# Altium schematic sheet P_PCIE_ETH.SchDoc
size 420 x 297 mm; Author: ALTIUM GOSTBOM2.0 KEV; SheetNumber: 25; SheetTotal: 48
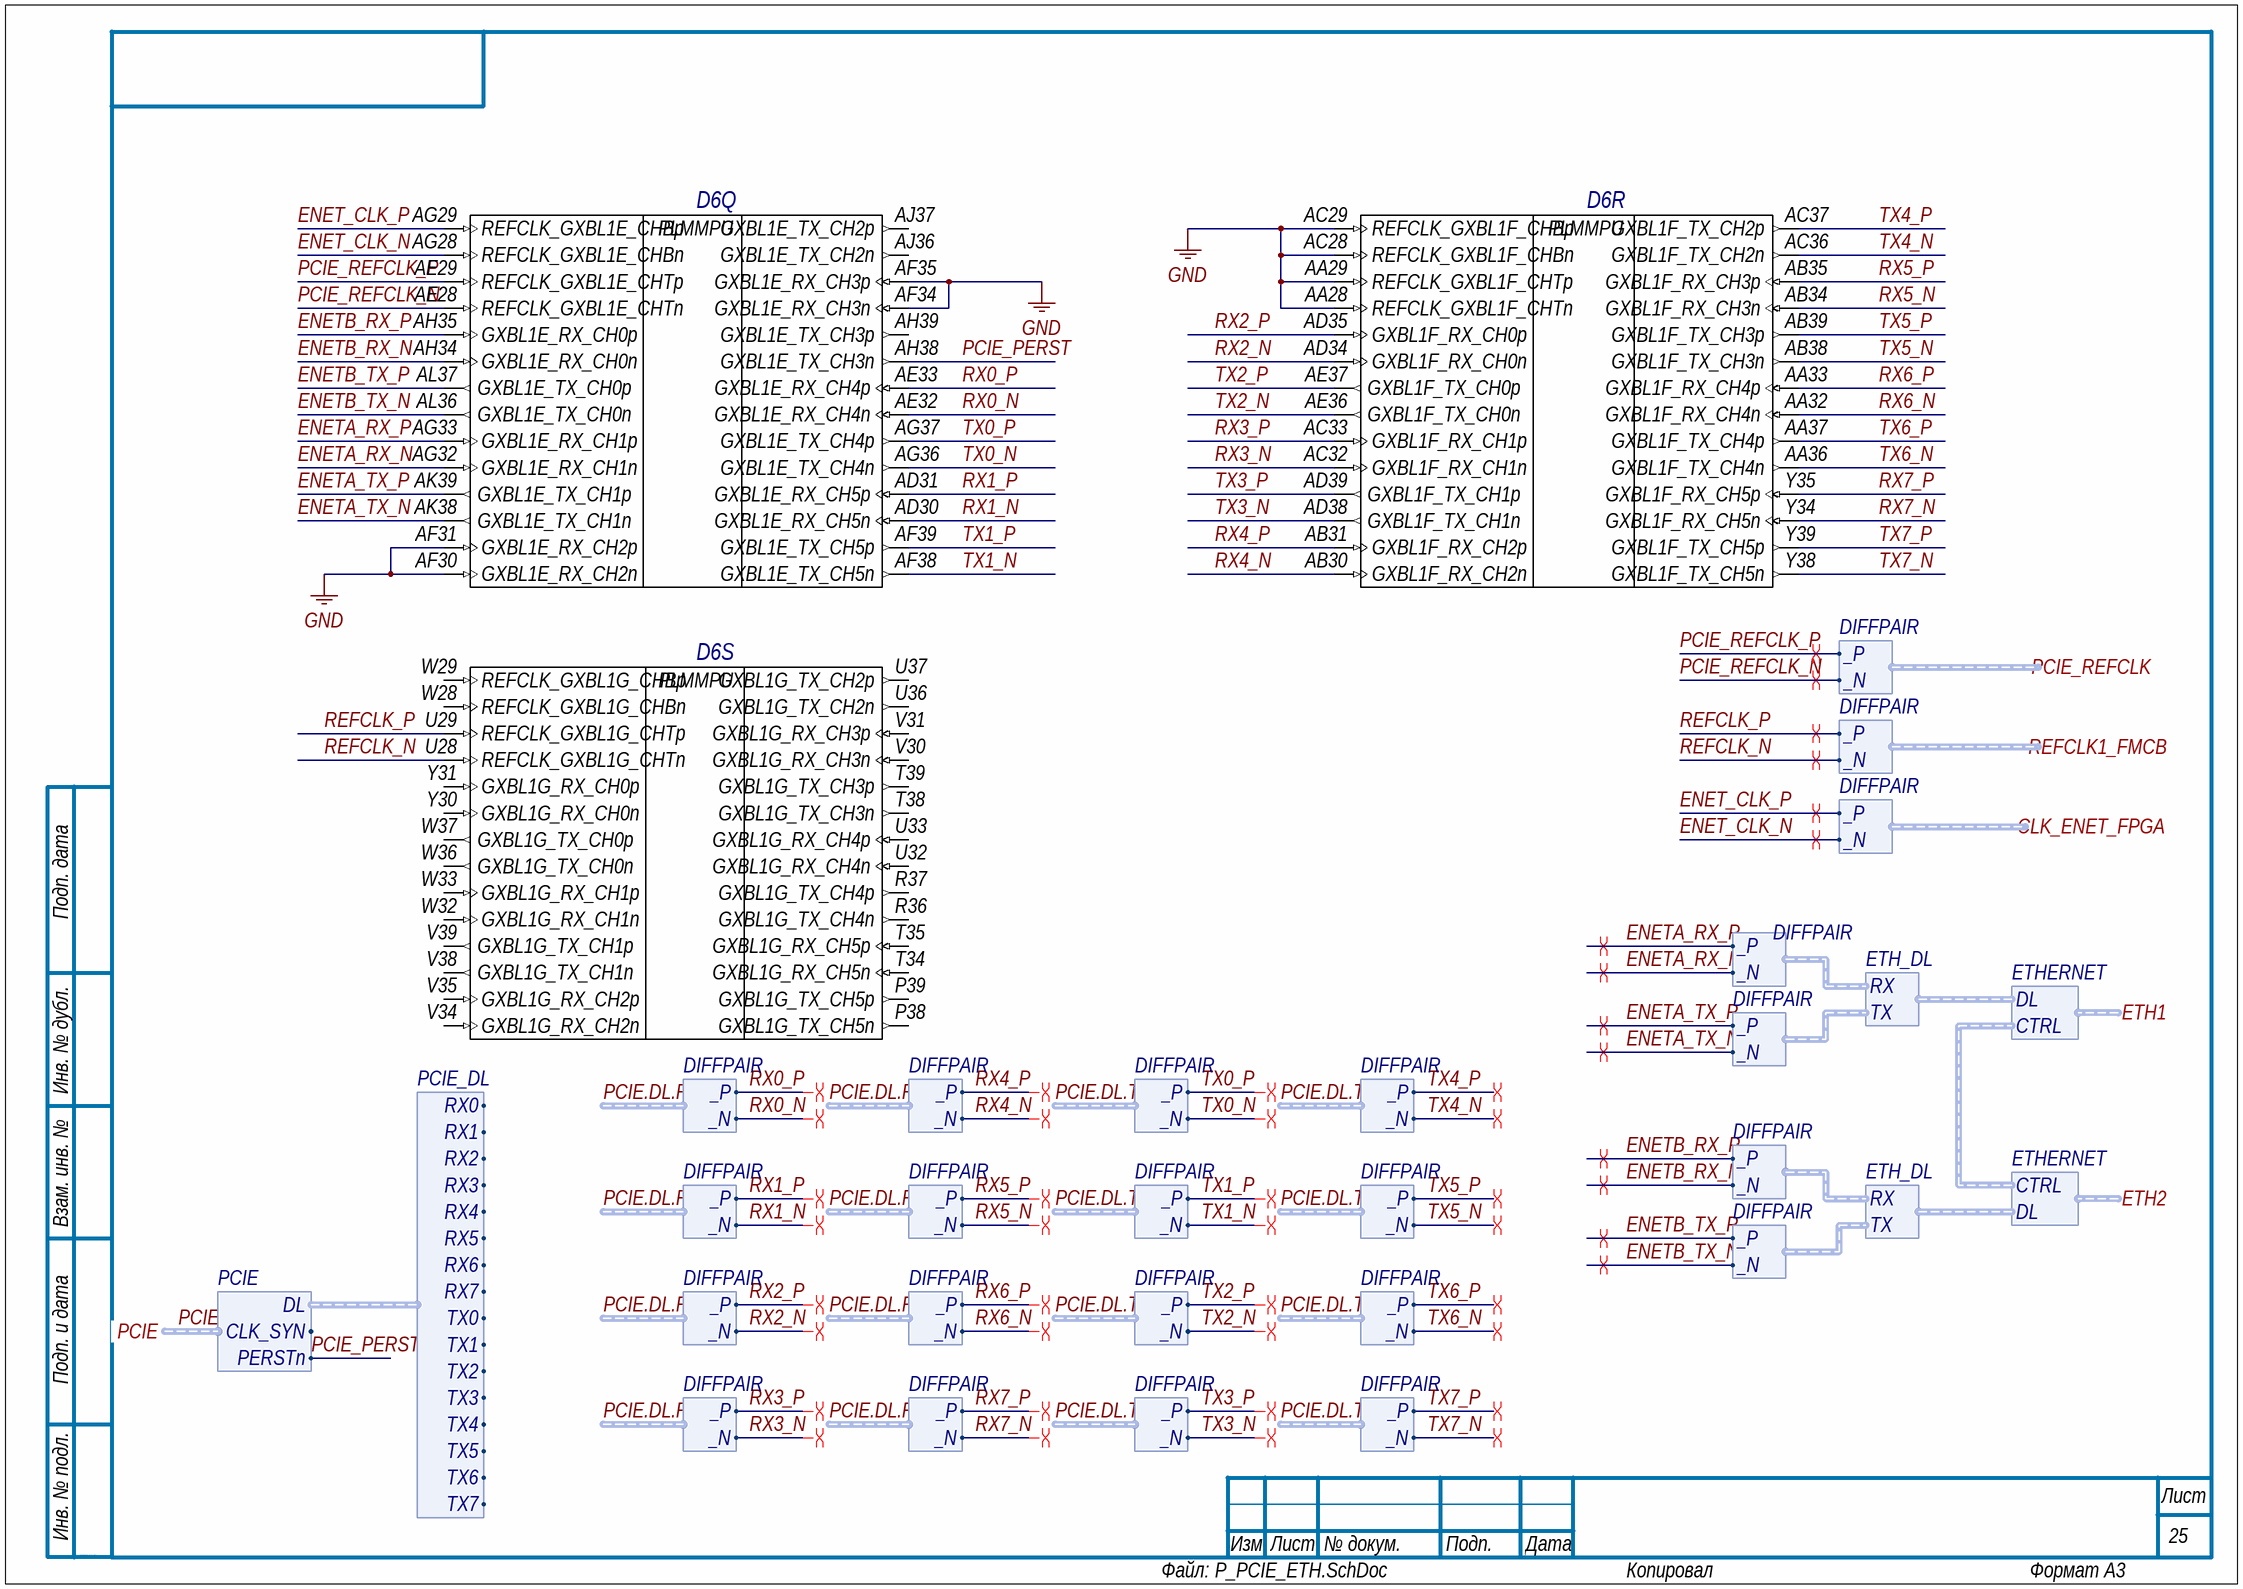
[diagram p0: P_PCIE_ETH.SchDoc]

## Parts
D6  10AS066N3F40E2SGE2  [ALTR-FBGA1517_A-350]  (value not drawn)  (parts Q,R,S of 39)

## Ports
CLK_ENET_FPGA (harness DIFFPAIR), ETH1 (harness ETHERNET), ETH2 (harness ETHERNET), PCIE (harness PCIE), PCIE_REFCLK (harness DIFFPAIR), REFCLK1_FMCB (harness DIFFPAIR)

## Harnesses
ETHERNET: DL, CTRL
ETH_DL: RX, TX
DIFFPAIR: _P, _N
PCIE: DL, CLK_SYN, PERSTn
PCIE_DL: RX0, RX1, RX2, RX3, RX4, RX5, RX6, RX7, TX0, TX1, TX2, TX3, TX4, TX5, TX6, TX7

## Nets
GND: D6.AA28(REFCLK_GXBL1F_CHTn) D6.AA29(REFCLK_GXBL1F_CHTp) D6.AC28(REFCLK_GXBL1F_CHBn) D6.AC29(REFCLK_GXBL1F_CHBp) D6.AF30(GXBL1E_RX_CH2n) D6.AF31(GXBL1E_RX_CH2p) D6.AF34(GXBL1E_RX_CH3n) D6.AF35(GXBL1E_RX_CH3p)
ENET_CLK_N: D6.AG28(REFCLK_GXBL1E_CHBn) ; port CLK_ENET_FPGA._N
ENET_CLK_P: D6.AG29(REFCLK_GXBL1E_CHBp) ; port CLK_ENET_FPGA._P
ENETA_RX_N: D6.AG32(GXBL1E_RX_CH1n) ; harness DIFFPAIR._N
ENETA_RX_P: D6.AG33(GXBL1E_RX_CH1p) ; harness DIFFPAIR._P
ENETA_TX_N: D6.AK38(GXBL1E_TX_CH1n) ; harness DIFFPAIR._N
ENETA_TX_P: D6.AK39(GXBL1E_TX_CH1p) ; harness DIFFPAIR._P
ENETB_RX_N: D6.AH34(GXBL1E_RX_CH0n) ; harness DIFFPAIR._N
ENETB_RX_P: D6.AH35(GXBL1E_RX_CH0p) ; harness DIFFPAIR._P
ENETB_TX_N: D6.AL36(GXBL1E_TX_CH0n) ; harness DIFFPAIR._N
ENETB_TX_P: D6.AL37(GXBL1E_TX_CH0p) ; harness DIFFPAIR._P
PCIE_PERST: D6.AH38(GXBL1E_TX_CH3n) ; port PCIE.PERSTn  [project net PCIE.PERSTn]
PCIE_REFCLK_N: D6.AE28(REFCLK_GXBL1E_CHTn) ; port PCIE_REFCLK._N
PCIE_REFCLK_P: D6.AE29(REFCLK_GXBL1E_CHTp) ; port PCIE_REFCLK._P
REFCLK_N: D6.U28(REFCLK_GXBL1G_CHTn) ; port REFCLK1_FMCB._N
REFCLK_P: D6.U29(REFCLK_GXBL1G_CHTp) ; port REFCLK1_FMCB._P
RX0_N: D6.AE32(GXBL1E_RX_CH4n) ; harness DIFFPAIR._N  [project net PCIE.DL.RX0._N]
RX0_P: D6.AE33(GXBL1E_RX_CH4p) ; harness DIFFPAIR._P  [project net PCIE.DL.RX0._P]
RX1_N: D6.AD30(GXBL1E_RX_CH5n) ; harness DIFFPAIR._N  [project net PCIE.DL.RX1._N]
RX1_P: D6.AD31(GXBL1E_RX_CH5p) ; harness DIFFPAIR._P  [project net PCIE.DL.RX1._P]
RX2_N: D6.AD34(GXBL1F_RX_CH0n) ; harness DIFFPAIR._N  [project net PCIE.DL.RX2._N]
RX2_P: D6.AD35(GXBL1F_RX_CH0p) ; harness DIFFPAIR._P  [project net PCIE.DL.RX2._P]
RX3_N: D6.AC32(GXBL1F_RX_CH1n) ; harness DIFFPAIR._N  [project net PCIE.DL.RX3._N]
RX3_P: D6.AC33(GXBL1F_RX_CH1p) ; harness DIFFPAIR._P  [project net PCIE.DL.RX3._P]
RX4_N: D6.AB30(GXBL1F_RX_CH2n) ; harness DIFFPAIR._N  [project net PCIE.DL.RX4._N]
RX4_P: D6.AB31(GXBL1F_RX_CH2p) ; harness DIFFPAIR._P  [project net PCIE.DL.RX4._P]
RX5_N: D6.AB34(GXBL1F_RX_CH3n) ; harness DIFFPAIR._N  [project net PCIE.DL.RX5._N]
RX5_P: D6.AB35(GXBL1F_RX_CH3p) ; harness DIFFPAIR._P  [project net PCIE.DL.RX5._P]
RX6_N: D6.AA32(GXBL1F_RX_CH4n) ; harness DIFFPAIR._N  [project net PCIE.DL.RX6._N]
RX6_P: D6.AA33(GXBL1F_RX_CH4p) ; harness DIFFPAIR._P  [project net PCIE.DL.RX6._P]
RX7_N: D6.Y34(GXBL1F_RX_CH5n) ; harness DIFFPAIR._N  [project net PCIE.DL.RX7._N]
RX7_P: D6.Y35(GXBL1F_RX_CH5p) ; harness DIFFPAIR._P  [project net PCIE.DL.RX7._P]
TX0_N: D6.AG36(GXBL1E_TX_CH4n) ; harness DIFFPAIR._N  [project net PCIE.DL.TX0._N]
TX0_P: D6.AG37(GXBL1E_TX_CH4p) ; harness DIFFPAIR._P  [project net PCIE.DL.TX0._P]
TX1_N: D6.AF38(GXBL1E_TX_CH5n) ; harness DIFFPAIR._N  [project net PCIE.DL.TX1._N]
TX1_P: D6.AF39(GXBL1E_TX_CH5p) ; harness DIFFPAIR._P  [project net PCIE.DL.TX1._P]
TX2_N: D6.AE36(GXBL1F_TX_CH0n) ; harness DIFFPAIR._N  [project net PCIE.DL.TX2._N]
TX2_P: D6.AE37(GXBL1F_TX_CH0p) ; harness DIFFPAIR._P  [project net PCIE.DL.TX2._P]
TX3_N: D6.AD38(GXBL1F_TX_CH1n) ; harness DIFFPAIR._N  [project net PCIE.DL.TX3._N]
TX3_P: D6.AD39(GXBL1F_TX_CH1p) ; harness DIFFPAIR._P  [project net PCIE.DL.TX3._P]
TX4_N: D6.AC36(GXBL1F_TX_CH2n) ; harness DIFFPAIR._N  [project net PCIE.DL.TX4._N]
TX4_P: D6.AC37(GXBL1F_TX_CH2p) ; harness DIFFPAIR._P  [project net PCIE.DL.TX4._P]
TX5_N: D6.AB38(GXBL1F_TX_CH3n) ; harness DIFFPAIR._N  [project net PCIE.DL.TX5._N]
TX5_P: D6.AB39(GXBL1F_TX_CH3p) ; harness DIFFPAIR._P  [project net PCIE.DL.TX5._P]
TX6_N: D6.AA36(GXBL1F_TX_CH4n) ; harness DIFFPAIR._N  [project net PCIE.DL.TX6._N]
TX6_P: D6.AA37(GXBL1F_TX_CH4p) ; harness DIFFPAIR._P  [project net PCIE.DL.TX6._P]
TX7_N: D6.Y38(GXBL1F_TX_CH5n) ; harness DIFFPAIR._N  [project net PCIE.DL.TX7._N]
TX7_P: D6.Y39(GXBL1F_TX_CH5p) ; harness DIFFPAIR._P  [project net PCIE.DL.TX7._P]

Not connected (* = marked no-connect by the designer): D6 AH39(GXBL1E_TX_CH3p) AJ36(GXBL1E_TX_CH2n) AJ37(GXBL1E_TX_CH2p) P38(GXBL1G_TX_CH5n) P39(GXBL1G_TX_CH5p) R36(GXBL1G_TX_CH4n) R37(GXBL1G_TX_CH4p) T34(GXBL1G_RX_CH5n) T35(GXBL1G_RX_CH5p) T38(GXBL1G_TX_CH3n) T39(GXBL1G_TX_CH3p) U32(GXBL1G_RX_CH4n) U33(GXBL1G_RX_CH4p) U36(GXBL1G_TX_CH2n) U37(GXBL1G_TX_CH2p) V30(GXBL1G_RX_CH3n) V31(GXBL1G_RX_CH3p) V34(GXBL1G_RX_CH2n) V35(GXBL1G_RX_CH2p) V38(GXBL1G_TX_CH1n) V39(GXBL1G_TX_CH1p) W28(REFCLK_GXBL1G_CHBn) W29(REFCLK_GXBL1G_CHBp) W32(GXBL1G_RX_CH1n) W33(GXBL1G_RX_CH1p) W36(GXBL1G_TX_CH0n) W37(GXBL1G_TX_CH0p) Y30(GXBL1G_RX_CH0n) Y31(GXBL1G_RX_CH0p)

## Buses and harness runs
harness PCIE = port PCIE

## Layout directives
differential pair: ENET_CLK_N, ENET_CLK_P, ENETA_RX_N, ENETA_RX_P, ENETA_TX_N, ENETA_TX_P, ENETB_RX_N, ENETB_RX_P, ENETB_TX_N, ENETB_TX_P, PCIE.DL.RX0._N, PCIE.DL.RX0._P, PCIE.DL.RX1._N, PCIE.DL.RX1._P, PCIE.DL.RX2._N, PCIE.DL.RX2._P, PCIE.DL.RX3._N, PCIE.DL.RX3._P, PCIE.DL.RX4._N, PCIE.DL.RX4._P, PCIE.DL.RX5._N, PCIE.DL.RX5._P, PCIE.DL.RX6._N, PCIE.DL.RX6._P, PCIE.DL.RX7._N, PCIE.DL.RX7._P, PCIE.DL.TX0._N, PCIE.DL.TX0._P, PCIE.DL.TX1._N, PCIE.DL.TX1._P, PCIE.DL.TX2._N, PCIE.DL.TX2._P, PCIE.DL.TX3._N, PCIE.DL.TX3._P, PCIE.DL.TX4._N, PCIE.DL.TX4._P, PCIE.DL.TX5._N, PCIE.DL.TX5._P, PCIE.DL.TX6._N, PCIE.DL.TX6._P, PCIE.DL.TX7._N, PCIE.DL.TX7._P, PCIE_REFCLK_N, PCIE_REFCLK_P, REFCLK_N, REFCLK_P

## Notes on the sheet
- Подп. дата
- Инв. № дубл.
- Взам. инв. №
- Подп. и дата
- Инв. № подл.
- Изм.
- Лист
- № докум.
- Подп.
- Дата
- ALTIUM GOSTBOM2.0 KEV
- Файл:
- Копировал
- Формат А3
- (in symbol E105, part Q) PLMMPU
- (in symbol E105, part R) PLMMPU
- (in symbol E105, part S) PLMMPU

## Library data of the parts
D6 = E105: Arria 10 SX Family, 588 I/O Pins, 16 Fractional PLLs, 1517-Pin FBGA, Speed Grade 2, Extended Grade, RoHS; Тип элемента: ПЛИС; Old_des: U1; New_des: D6; UID: E105; Component Kind: Standard; ComponentLink1Description: Manufacturer URL; ComponentLink1URL: https://www.altera.com/; ComponentLink2Description: Datasheet; ComponentLink2URL: https://www.altera.com/content/dam/altera-www/global/en_US/pdfs/literature/hb/arria-10/a10_datasheet.pdf; DatasheetVersion: Rev. 2016-06-24, 06/2016; Mounting Technology: Surface Mount; PackageDescription: 1517-Pin FineLine Ball-Grid Array (FBGA), Body 40 x 40 mm, Pitch 1 mm; PartNumber: 10AS066N3F40E2SGE2; Code_JEDEC: MS-034; ComponentLink3Description: Package Specification; ComponentLink3URL: https://www.altera.com/content/dam/altera-www/global/en_US/pdfs/literature/packaging/04r00461-04.pdf; PackageVersion: Rev. 5.0, 01/2016